# Altium schematic sheet CANShield.SchDoc
size A
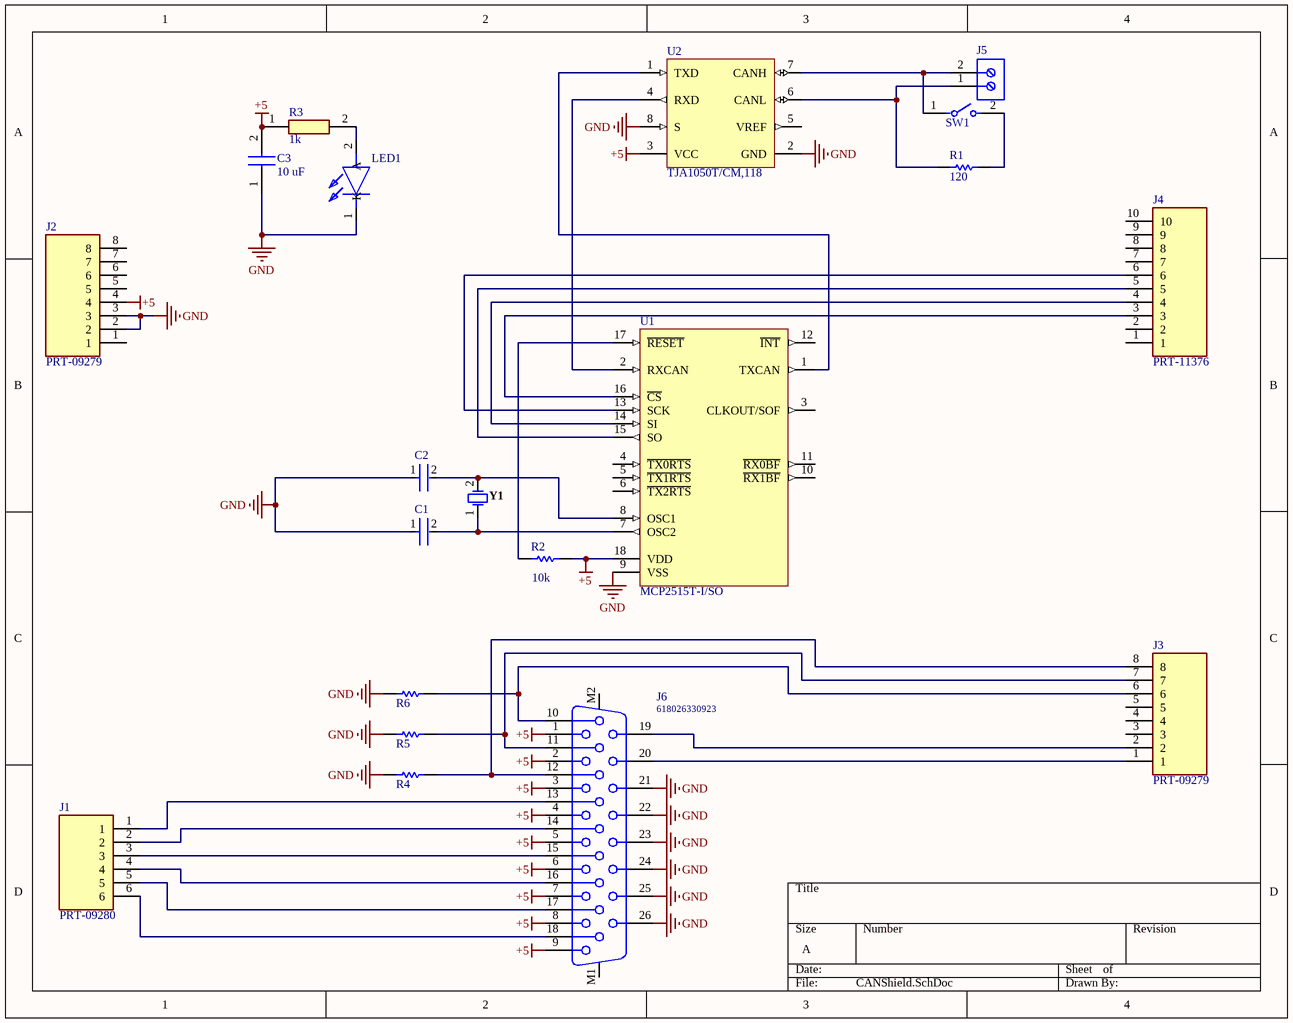
[diagram p0: CANShield.SchDoc]

## Parts
C1  C0402C220J8HACTU  [FP-C0402-BB-MFG]  (value not drawn)
C2  C0402C220J8HACTU  [FP-C0402-BB-MFG]  (value not drawn)
C3  10 uF  [CAPC1005X55N]
J1  PRT-09280  [SHDR6W80P0X254_1X6_1579X250X865P]
J2  PRT-09279  [SHDR8W87P0X254_1X8_2087X250X865P]
J3  PRT-09279  [SHDR8W87P0X254_1X8_2087X250X865P]
J4  PRT-11376  [SHDR10W107P0X254_1X10_2595X250X865P]
J5  691137710002  [691137710002]  (value not drawn)
J6  618026330923  [618026330923]
LED1  150060RS55040  [150060RS55040]  (value not drawn)
R1  120  [RESC3216X60X45LL10T20]
R2  CRCW040210K0FKED  [RESC1005X40X25NL05T05]  (value not drawn)
R3  1k  [RESC2013X55N]
R4  CRCW040210K0FKED  [RESC1005X40X25NL05T05]  (value not drawn)
R5  CRCW040210K0FKED  [RESC1005X40X25NL05T05]  (value not drawn)
R6  CRCW040210K0FKED  [RESC1005X40X25NL05T05]  (value not drawn)
SW1  5161390-1  [FP-5161390-1-MFG]  (value not drawn)
U1  MCP2515T-I/SO  [SOIC-SO18_N]
U2  TJA1050T/CM,118  [NXP-SOT96-1_M]
Y1  FOXSDLF/080-20  [FOX-HC49SDLF_V]  (value not drawn)

## Nets
+5: C3.2 J2.4 J6.1 J6.2 J6.3 J6.4 J6.5 J6.6 J6.7 J6.8 J6.9 R2.2 R3.1 U1.18(VDD) U2.3(VCC)
GND: C1.1 C2.1 C3.1 J2.2 J2.3 J6.21 J6.22 J6.23 J6.24 J6.25 J6.26 LED1.1(K) R4.1 R5.1 R6.1 U1.9(VSS) U2.2(GND) U2.8(S)
NetC1_2: C1.2 U1.7(OSC2) Y1.1
NetC2_2: C2.2 U1.8(OSC1) Y1.2
NetJ1_1: J1.1 J6.13
NetJ1_2: J1.2 J6.14
NetJ1_3: J1.3 J6.15
NetJ1_4: J1.4 J6.16
NetJ1_5: J1.5 J6.17
NetJ1_6: J1.6 J6.18
NetJ3_1: J3.1 J6.20
NetJ3_2: J3.2 J6.19
NetJ3_6: J3.6 J6.10 R6.2
NetJ3_7: J3.7 J6.11 R5.2
NetJ3_8: J3.8 J6.12 R4.2
NetJ4_3: J4.3 U1.16(~{CS})
NetJ4_4: J4.4 U1.14(SI)
NetJ4_5: J4.5 U1.15(SO)
NetJ4_6: J4.6 U1.13(SCK)
NetJ5_1: J5.1 R1.2 U2.6(CANL)
NetJ5_2: J5.2 SW1.1 U2.7(CANH)
NetLED1_2: LED1.2(A) R3.2
NetR1_1: R1.1 SW1.2
NetR2_1: R2.1 U1.17(~{RESET})
NetU1_1: U1.1(TXCAN) U2.1(TXD)
NetU1_2: U1.2(RXCAN) U2.4(RXD)

Not connected (* = marked no-connect by the designer): J2 1 5 6 7 8; J3 3 4 5; J4 1 2 7 8 9 10; J6 M1 M2; U1 3(CLKOUT/SOF) 4(~{TX0RTS}) 5(~{TX1RTS}) 6(~{TX2RTS}) 10(~{RX1BF}) 11(~{RX0BF}) 12(~{INT}); U2 5(VREF)

## Notes on the sheet
- (near R2) 10k

## Library data of the parts
C1 C2 = CMP-03020-002266-1: C0402 22 pF X8R 5.00% 10 V; Manufacturer: Kemet; Voltage Rating: 10 V; Material: Ceramic; Capacitance: 22 pF; Temperature Coefficient: 15%; Tolerance: 0.05; Value: 22 pF; ComponentLink2URL: https://content.kemet.com/datasheets/KEM_C1002_X7R_SMD.pdf; Device Class L2: Capacitors; Temperature Range High: +125°C; Device Class L1: Passive Components; Package: C0402-BB; Automotive: No; RoHS: TRUE; Ipc Land Pattern Name: CAPC10050X50; Device Class L3: Ceramic Capacitors; Temperature Range Low: -55°C; ComponentLink2Description: Datasheet; Temperature Characteristic: X8R; Lead Free: Yes; Category: Cap; Octopart: https://octopart.com/c0402c220j8hactu-kemet-88724303; Manufacturer Part Number: C0402C220J8HACTU; Temperature: -55°C to +125°C; Height: 0.55mm
C3 = 0402X106M6R3CT: Capacitor; Manufacturer_Name: Walsin Technology Corporation; Datasheet Link: https://mouser.componentsearchengine.com/Datasheets/1/0402X106M6R3CT.pdf; Height: 0.55mm; Manufacturer_Part_Number: 0402X106M6R3CT; Arrow Part Number: 0402X106M6R3CT; Mouser Part Number: 791-0402X106M6R3CT; Mouser Price/Stock: https://www.mouser.co.uk/ProductDetail/Walsin/0402X106M6R3CT?qs=K66U1JmYfS7Y7bXr0va0Xw%3D%3D
J1 = PRT-09280: Connector; Manufacturer_Name: SparkFun; Datasheet Link: https://www.sparkfun.com/products/9280; Height: 8.65mm; Manufacturer_Part_Number: PRT-09280; Arrow Part Number: PRT-09280; Arrow Price/Stock: https://www.arrow.com/en/products/prt-09280/sparkfun-electronics; Mouser Part Number: 474-PRT-09280; Mouser Price/Stock: https://www.mouser.co.uk/ProductDetail/SparkFun/PRT-09280?qs=WyAARYrbSnZbYI2JbCpVjQ%3D%3D
J2 J3 = PRT-09279: Capacitor; Manufacturer_Name: SparkFun; Datasheet Link: https://cdn.sparkfun.com/datasheets/Prototyping/SP-140520-XX-001.pdf; Height: 8.65mm; Manufacturer_Part_Number: PRT-09279; Arrow Part Number: PRT-09279; Arrow Price/Stock: https://www.arrow.com/en/products/prt-09279/sparkfun-electronics; Mouser Part Number: 474-PRT-09279; Mouser Price/Stock: https://www.mouser.co.uk/ProductDetail/SparkFun/PRT-09279?qs=WyAARYrbSnZoWn%2FpXY8lrw%3D%3D
J4 = PRT-11376: Capacitor; Manufacturer_Name: SparkFun; Datasheet Link: https://cdn.sparkfun.com/datasheets/Prototyping/SP-140520-XX-001.pdf; Height: 8.65mm; Manufacturer_Part_Number: PRT-11376; Arrow Part Number: PRT-11376; Arrow Price/Stock: https://www.arrow.com/en/products/prt-11376/sparkfun-electronics; Mouser Part Number: 474-PRT-11376; Mouser Price/Stock: https://www.mouser.co.uk/ProductDetail/SparkFun/PRT-11376?qs=WyAARYrbSnZQXyABk0oWeA%3D%3D
J5 = CMP-1502-03324-1: Series 1377 - 5.00 mm Horizontal Entry with Pressure Clamp WR-TBL, 2 pin; Manufacturer: Wurth Elektronik; Pin Number: 2; Pitch: 5.00mm; Operating Temperature: -30to120degC; Package Reference: 691137710002; Publisher: WurthElektronik; Mounting Technology: THT; Manufacturer URL: http://www.we-online.de; Packaging: Box; Part Number: 691137710002; Datasheet URL: http://katalog.we-online.de/pbs/datasheet/691137710002.pdf
J6 = CMP-1502-00217-1: Female High Density PCB Connector with Hex Screw WR-DSUB, Angled, 26 pins; Manufacturer: Wurth Elektronik; Working Voltage: 60VAC; Pin Number: 26; Contact Resistance: 30mOhm; Rated Current: 3A; Gender: Female; Packaging: Tray; Datasheet URL: https://katalog.we-online.de/em/datasheet/6180xx330923.pdf; Package Reference: 618026330923; Publisher: WurthElektronik; Orientation: Angled; Manufacturer URL: http://www.we-online.de; Operating Temperature: -40to85degC; Part Number: 618026330923; Mounting Technology: THT
LED1 = 150060RS55040: LED; Manufacturer_Name: Wurth Elektronik; Datasheet Link: http://katalog.we-online.de/led/datasheet/150060RS55040.pdf; Height: 0mm; Manufacturer_Part_Number: 150060RS55040; Arrow Part Number: 150060RS55040; Mouser Part Number: 710-150060RS55040; Mouser Price/Stock: https://www.mouser.co.uk/ProductDetail/Wurth-Elektronik/150060RS55040?qs=8Aam6%252B7C6HHnMZFlrlTntA%3D%3D
R1 = CMP-2003-04838-1: Part Number: CRCW1206120RFKEA; Manufacturer: Vishay Dale
R2 R4-R6 = CMP-2002-08135-1: Manufacturer: Vishay Dale; Part Number: CRCW040210K0FKED
R3 = RGA2012P-102-B-T1: Resistor; Manufacturer_Name: Susumu; Datasheet Link: https://componentsearchengine.com/Datasheets/1/RGA2012P-102-B-T1.pdf; Height: 0.55mm; Manufacturer_Part_Number: RGA2012P-102-B-T1; Arrow Part Number: RGA2012P-102-B-T1; Mouser Part Number: 754-RGA2012P-102BT1; Mouser Price/Stock: https://www.mouser.co.uk/ProductDetail/Susumu/RGA2012P-102-B-T1?qs=bZr6mbWTK5kDA0FAdzRgYA%3D%3D
SW1 = CMP-03400-000007-1: Switch DIP OFF ON SPST 1 Top Slide 25A 50VDC PC Pins 2.54mm Thru-Hole Box/Carton; Manufacturer: TE; Contact Current Rating: 25mA; Number Of Circuits: 1; Voltage Rating Dc: 50V; Electromechanical Life: 2000Cycles; Device Class L2: Switches; Throw Configuration: SPST; Package: 5161390-1; Mount: Through Hole; Octopart: https://octopart.com/5161390-1-te+connectivity-46507634; ComponentLink2URL: https://www.te.com/usa-en/product-5161390-1.html?te_bu=Cor&te_type=other&te_campaign=oct_glo_cor-oct-global-oth-prtnr-fy19-oct-octo-buy-bom_sma-298_2&elqCampaignId=35216; Temperature Range High: +70°C; RoHS: TRUE; Device Class L1: Electromechanical; Temperature: -25°C to +70°C; ComponentLink2Description: Datasheet; Height: 8.5mm; Automotive: No; Temperature Range Low: -25°C; Manufacturer Part Number: 5161390-1; Mouser Description: Switch DIP OFF ON SPST 1 Top Slide 25A 50VDC PC Pins 2.54mm Thru-Hole Box/Carton; Device Class L3: DIP Switches; Lead Free: Yes; Category: Switch
U1 = CMP-0186-00139-2: Stand-Alone CAN Controller With SPI Interface, 18-Pin SOIC, Industrial Temperature, Tape and Reel; RevisionNote: URLs added. DatasheetVersion updated.; ComponentLink1Description: Manufacturer URL; Code_JEDEC: MS-013; ComponentLink2URL: http://ww1.microchip.com/downloads/en/DeviceDoc/21801f.pdf; ComponentLink3Description: Package Specification; PackageVersion: revBB, Aug-2009; PackageReference: SOIC-SO18; ComponentLink2Description: Datasheet; DatasheetVersion: revF, Oct-2010; PackageDescription: 18-Lead Plastic Small Outline (SO) - Wide 7.50mm Body [SOIC]; ComponentLink1URL: http://www.microchip.com/; ComponentLink3URL: http://www.microchip.com/stellent/groups/techpub_sg/documents/packagingspec/en012702.pdf
U2 = CMP-2000-04923-1: High speed CAN transceiver, 4.75 to 5.25 V, -40 to 150 degC, 8-Pin SO (SOT96-1), RoHS, Tape and Reel; Manufacturer: NXP Semiconductors; Duplex: Half; Number of Drivers/Receivers: 1/1; Product Training Modules: CANandLINBusTransceiver; Receiver Hysteresis: 70mV; Voltage - Supply: 4.75V~5.25V; Dynamic Catalog: CANTransceivers; Other Names: 568-10292-1; PCN Packaging: LighterPackingReels30/Mar/2014; PCN Obsolescence: TJA105028/Apr/2013 / MultipleDevices19/Apr/2013; Standard Package: 1; Family: Interface-Drivers,Receivers,Transceivers; Package Reference: SOT96-1; Mounting Type: SurfaceMount; Package / Case: 8-SOIC(0.154",3.90mmWidth); Package Description: 8-Pin Small Outline Integrated Circuit, Body 4.9 x 3.9 mm, Pitch 1.27 mm; Protocol: CAN; Package/Case: 8-SOIC(0.154",3.90mmWidth); Supplier Device Package: 8-SO; <PCN>: http://media.digikey.com/pdf/PCNs/NXP/201209019F04_TJA1050_Obs.pdf; Minimum Quantity: Transceiver; Datasheet URL: http://www.nxp.com/documents/data_sheet/TJA1050.pdf; Category: IntegratedCircuits(ICs); Quantity Available: CutTape(CT)AlternatePackaging; Datasheet Version: Rev. 4, 10/2003; Type: Transceiver; Packaging: CutTape(CT); Manufacturer URL: http://www.nxp.com/
Y1 = CMP-2100-03639-1: Resistance Weld Crystal, 8 MHz, +/- 30 ppm, -20 to 70 degC, 2-Pin SMD, RoHS, Tape and Reel; Manufacturer: FOX Electronics; Series Resistance: 80Ohm; Frequency: 8MHz; Load Capacitance: 20pF; Tolerance: 50ppm; Frequency Tolerance: 30ppm; Datasheet URL: http://www.foxonline.com/pdfs/hc49sdlf.pdf; Package Reference: HC49SDLF; Height: 4.5mm; Mount: SurfaceMount; Packaging: TapeandReel; Length: 11.7mm; Termination: SMD/SMT; Number of Pins: 2; Depth: 5mm; Min Operating Temperature: -20degC; Package Quantity: 1000; RoHSCompliant: True; Lead Free: LeadFree; Width: 5mm; Case/Package: SMD/SMT; Manufacturer URL: http://www.foxonline.com/; Max Operating Temperature: 70degC; REACH SVHC: NoSVHC; Datasheet Version: 42064.0; Package Description: 2-Pin Surface Mount Device, Body 5 x 11.7 mm; Frequency Stability: 50ppm; ESR (Equivalent Series Resistance): 80Ohm; Radiation Hardening: No